# EAGLE design v1-alarm (EAGLE 6.4)
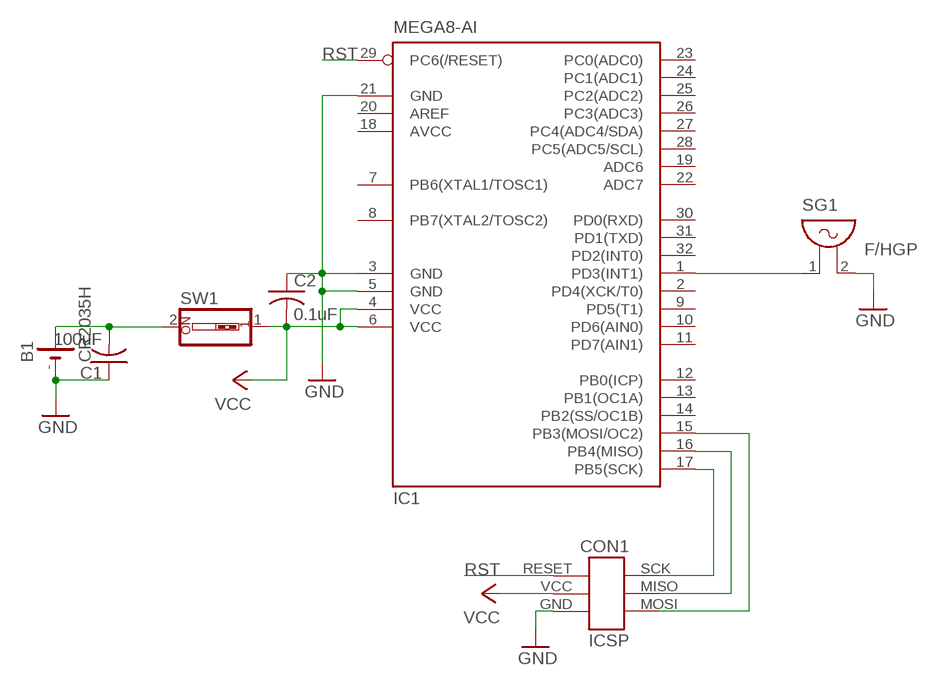
[diagram p0: schematic, sheet 1]

## Parts
B1  CR2035H  [CR2032H]
C1  100uF  C-USC2220K  [C2220K]
C2  0.1uF  C-USC0603  [C0603]
CON1  ICSP-HEADER  [ICSP-HEADER]
IC1  MEGA8-AI  [TQFP32-08]
SG1  F/HGP  [F/HGP]
SW1  SW_DIP-1  [EDG-01]

## Nets
GND: B1.- C1.1 C2.1 CON1.GND IC1.3(GND) IC1.5(GND) IC1.21(GND) SG1.2
N$1: CON1.SCK IC1.17(PB5(SCK))
N$2: CON1.MISO IC1.16(PB4(MISO))
N$3: CON1.MOSI IC1.15(PB3(MOSI/OC2))
N$4: B1.+ C1.2 SW1.2
N$5: IC1.1(PD3(INT1)) SG1.1
RST: CON1.RESET IC1.29(PC6(/RESET))
VCC: C2.2 CON1.VCC(+5V) IC1.4(VCC) IC1.6(VCC) SW1.1
Unconnected: IC1.2(PD4(XCK/T0)) IC1.7(PB6(XTAL1/TOSC1)) IC1.8(PB7(XTAL2/TOSC2)) IC1.9(PD5(T1)) IC1.10(PD6(AIN0)) IC1.11(PD7(AIN1)) IC1.12(PB0(ICP)) IC1.13(PB1(OC1A)) IC1.14(PB2(SS/OC1B)) IC1.19(ADC6) IC1.20(AREF) IC1.22(ADC7) IC1.23(PC0(ADC0)) IC1.24(PC1(ADC1)) IC1.25(PC2(ADC2)) IC1.26(PC3(ADC3)) IC1.27(PC4(ADC4/SDA)) IC1.28(PC5(ADC5/SCL)) IC1.30(PD0(RXD)) IC1.31(PD1(TXD)) IC1.32(PD2(INT0))

## Power pins joined to a net without a drawn wire
AVCC: IC1.18(AVCC)

## Library data of the parts
B1 = serge:CR2035H
C1 C2 = adafruit:C-US: CAPACITOR, American symbol
CON1 = serge:ICSP-HEADER
IC1 = atmel:MEGA8: MICROCONTROLLER 8 Kbytes FLASH, 1 kbytes SRAM, 512 bytes EEPROM, USART, 6-channel 10 bit ADC, 2-channel 8 bit ADC Pin compatible with Atmega48, ATMega88, ATMega168 Source: avr.lbr; MPN: ATMEGA8-16AU; OC_FARNELL: 9171371; OC_NEWARK: 73M8863
SG1 = buzzer:F/HGP: BUZZER Source: Buerklin; OC_FARNELL: unknown; OC_NEWARK: unknown
SW1 = special:SW_DIP-1: DIP SWITCH

## Board
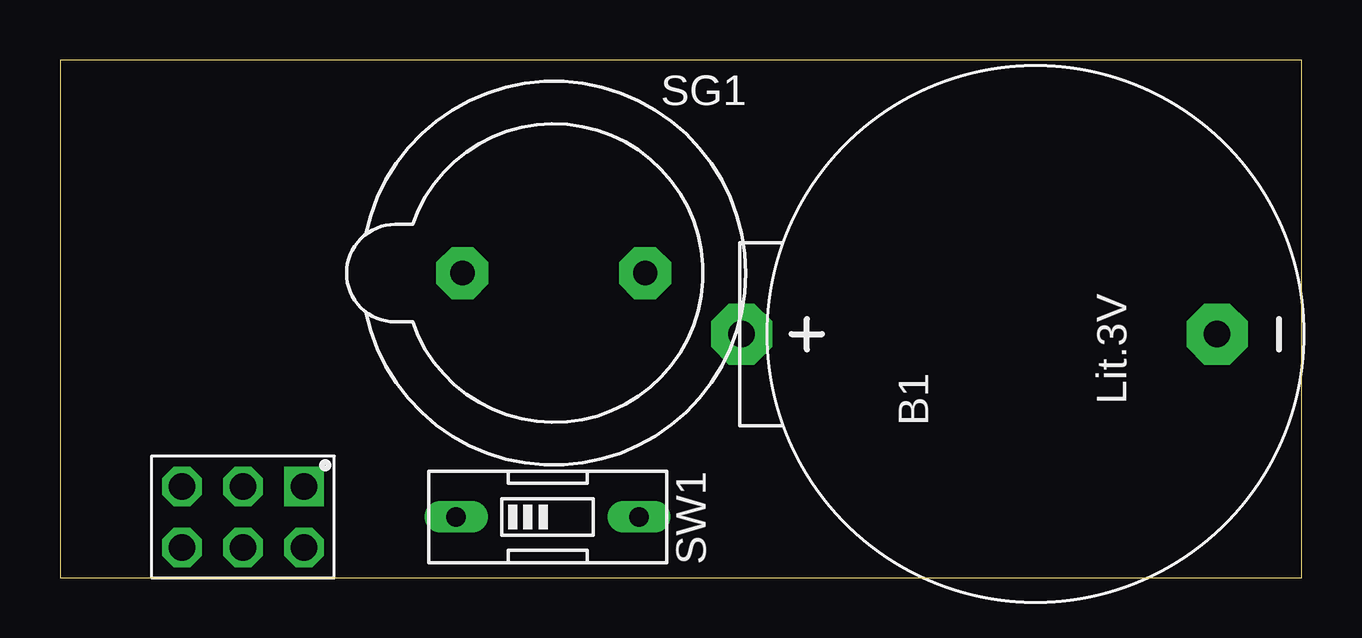
[diagram p1: board, top side]
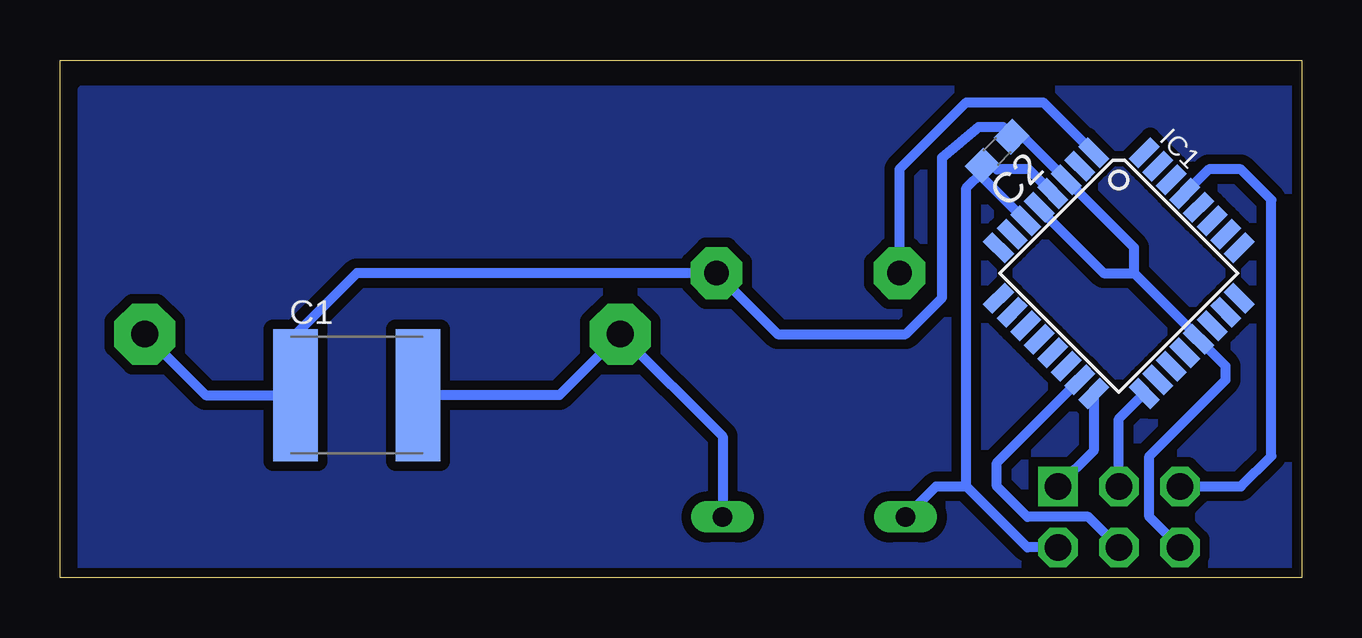
[diagram p2: board, bottom side, seen from below]

Size 51.74 x 21.58 mm. Coordinates in mm from the lower left corner, seen from the top.
Outline: 0,0 51.74,0 51.74,21.58 0,21.58 0,0
Copper layers (1*16): Top 0.035mm / dielectric 1.5mm / Bottom 0.035mm
Design rules "default": minimum track width 10mil, minimum drill 24mil, track to track 16mil, track to pad 16mil, pad to pad 16mil, via to via 16mil, smd to smd 16mil, copper to edge 16mil, drill to drill 8mil, minimum pad ring 10mil, minimum via ring 8mil, stop-mask expansion 4mil, vias tented up to drill 0mil, thermal gap 10mil

### Footprints (pad centres in the part's own frame; a part is rotated, then mirrored left to right if it is on the bottom)
CR2032H = drill 1.118 pad 2.54 octagon: + 0,10.973; - 0,-8.839
C2220K = smd 1.85 x 5.5: 1 -2.55,0; 2 2.55,0
C0603 = smd 1.1 x 1: 1 -0.85,0; 2 0.85,0
ICSP-HEADER = drill 1.1 octagon: GND 1.27,-3.81; MOSI 1.27,-1.27; RESET -1.27,-3.81; SCK -1.27,-1.27; VCC 1.27,1.27 | drill 1.1 square: MISO -1.27,1.27
TQFP32-08 = smd 1.27 x 0.559: 1 -4.293,2.8; 2 -4.293,2; 3 -4.293,1.2; 4 -4.293,0.4; 5 -4.293,-0.4; 6 -4.293,-1.2; 7 -4.293,-2; 8 -4.293,-2.8; 17 4.293,-2.8; 18 4.293,-2; 19 4.293,-1.2; 20 4.293,-0.4; 21 4.293,0.4; 22 4.293,1.2; 23 4.293,2; 24 4.293,2.8 | smd 0.559 x 1.27: 9 -2.8,-4.293; 10 -2,-4.293; 11 -1.2,-4.293; 12 -0.4,-4.293; 13 0.4,-4.293; 14 1.2,-4.293; 15 2,-4.293; 16 2.8,-4.293; 25 2.8,4.293; 26 2,4.293; 27 1.2,4.293; 28 0.4,4.293; 29 -0.4,4.293; 30 -1.2,4.293; 31 -2,4.293; 32 -2.8,4.293
F/HGP = drill 1.016 pad 2.159 octagon: 1 -3.81,0; 2 3.81,0
EDG-01 = drill 0.813 long: 1 0,-3.81; 2 0,3.81

### Placement (x,y rotation side)
B1  39.37,10.16 90 top
C1  39.37,7.62 0 bottom
C2  12.7,17.78 225 bottom
CON1  8.89,2.54 270 top
IC1  7.62,12.7 315 bottom
SG1  20.57,12.7 0 top
SW1  20.32,2.54 270 top

### Tracks (layer width: path | path; a pad name or v marks a point on that pad's centre or on a via)
GND
  Bottom 0.406: CON1.GND 6.35,2.54 6.35,5.08 3.17,8.26 3.17,8.82 IC1.21 4.3,10.02 6.99,12.7 | 6.99,12.7 6.99,13.76 IC1.3 11.6,18.38 C2.1 12.1,18.45 12.45,18.8 13.46,18.8 14.99,17.53 14.99,11.68 16.51,10.16 21.84,10.16 SG1.2 39.37,12.7 41.92,10.15 C1.1 45.67,7.62 B1.- | IC1.5 10.94,15.38 8.26,12.7 6.99,12.7
N$1
  Bottom 0.406: CON1.SCK 7.62,6.63 IC1.17
N$2
  Bottom 0.406: IC1.16 8.68,5.29 CON1.MISO
N$3
  Bottom 0.406: CON1.MOSI 8.89,2.54 11.43,2.54 12.7,3.81 12.7,4.79 IC1.15
N$4
  Bottom 0.406: SW1.2 24.13,5.89 B1.+ 30.94,7.62 C1.2
N$5
  Bottom 0.406: IC1.1 10.77,19.81 13.97,19.81 16.76,17.02 SG1.1
N$6
  pour Bottom: 0,0 50.8,0 50.8,20.32 0,20.32
RST
  Bottom 0.406: CON1.RESET 2.54,3.81 1.27,5.08 1.27,15.75 2.54,17.02 3.87,17.02 IC1.29
VCC
  Bottom 0.406: IC1.6 13.3,16.68 C2.2 | IC1.4 11.37,17.02 12.7,17.02 12.86,17.18 C2.2 | CON1.VCC 11.43,1.27 13.97,3.81 | 13.97,3.81 13.97,16.26 13.3,16.93 C2.2 | SW1.1 15.24,3.81 13.97,3.81